# EAGLE design SensorPCB (EAGLE 7.4.0)
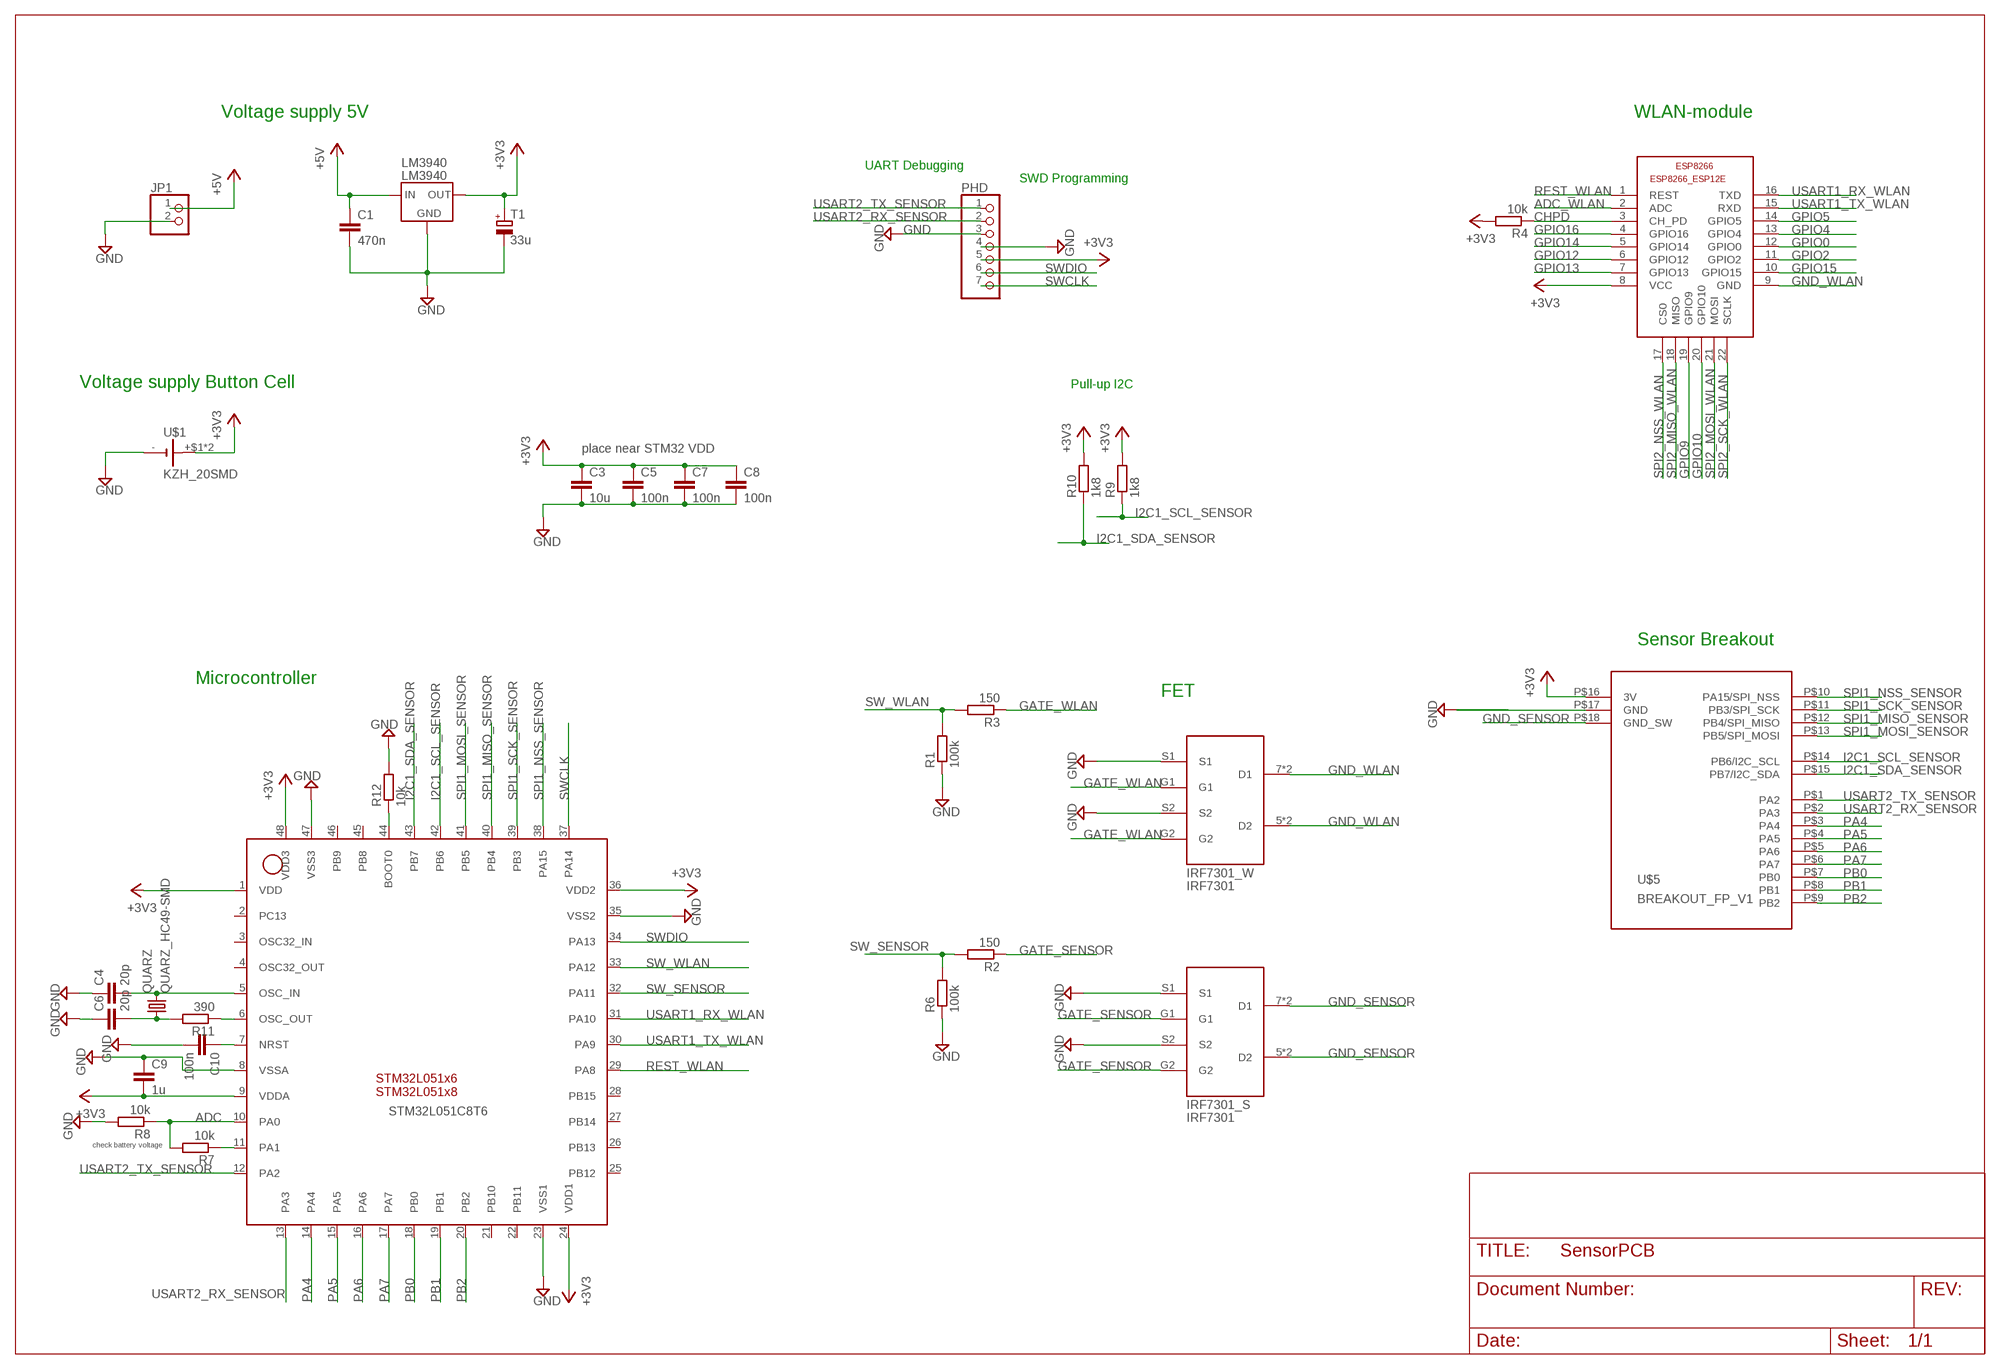
[diagram p0: schematic, sheet 1]

## Parts
C1  470n  C-EUC0805  [C0805]
C3  10u  C-EUC0805  [C0805]
C4  20p  C-EUC0805  [C0805]
C5  100n  C-EUC0805  [C0805]
C6  20p  C-EUC0805  [C0805]
C7  100n  C-EUC0805  [C0805]
C8  100n  C-EUC0805  [C0805]
C9  1u  C-EUC0805  [C0805]
C10  100n  C-EUC0805  [C0805]
ESP8266  ESP8266-12EESP8266-ESP12E  [ESP8266-ESP12E]
IRF7301_S  IRF7301  [IRF7301_PACK_SO8]
IRF7301_W  IRF7301  [IRF7301_PACK_SO8]
JP1  PINHD-1X2_2.54-SMD  [1X02SMD]
LM3940  LM3940  [LM3940_PACK]
PHD  PINHD-1X7_2.54-SMD  [1X07SMD]
QUARZ  QUARZ_HC49-SMD  [HC49-SMD]
R1  100k  R-EU_R0805  [R0805]
R2  150  R-EU_R0805  [R0805]
R3  150  R-EU_R0805  [R0805]
R4  10k  R-EU_R0805  [R0805]
R6  100k  R-EU_R0805  [R0805]
R7  10k  R-EU_R0805  [R0805]
R8  10k  R-EU_R0805  [R0805]
R9  1k8  R-EU_R0805  [R0805]
R10  1k8  R-EU_R0805  [R0805]
R11  390  R-EU_R0805  [R0805]
R12  10k  R-EU_R0805  [R0805]
STM32L051C8T6  STM32L051X6/8  [LQFP48]
T1  33u  CAP_TANTAL_1206  [1206]
U$1  KZH_20SMD  [KHZ_20SMD]
U$5  BREAKOUT_FP_V1  [BREAKOUT_FOOTPRINT_V1]

## Nets
+3V3: C3.1 C5.1 C7.1 C8.1 C9.2 ESP8266.8(VCC) LM3940.3(OUT) PHD.5 R4.2 R9.2 R10.2 STM32L051C8T6.1(VDD) STM32L051C8T6.9(VDDA) STM32L051C8T6.24(VDD1) STM32L051C8T6.36(VDD2) STM32L051C8T6.48(VDD3) T1.1(+) U$1.+$1(+) U$1.+$2(+) U$5.P$16(3V)
+5V: C1.1 JP1.1 LM3940.1(IN)
ADC: R7.2 R8.1 STM32L051C8T6.10(PA0)
ADC_WLAN: ESP8266.2(ADC)
CHPD: ESP8266.3(CH_PD) R4.1
GATE_SENSOR: IRF7301_S.G1 IRF7301_S.G2 R2.1
GATE_WLAN: IRF7301_W.G1 IRF7301_W.G2 R3.1
GND: C1.2 C3.2 C4.1 C5.2 C6.1 C7.2 C8.2 C9.1 C10.2 IRF7301_S.S1 IRF7301_S.S2 IRF7301_W.S1 IRF7301_W.S2 JP1.2 LM3940.2(GND) LM3940.4(GND) PHD.3 PHD.4 R1.1 R6.1 R8.2 R12.2 STM32L051C8T6.8(VSSA) STM32L051C8T6.23(VSS1) STM32L051C8T6.35(VSS2) STM32L051C8T6.47(VSS3) T1.2(-) U$1.- U$5.P$17(GND)
GND_SENSOR: IRF7301_S.5(D2) IRF7301_S.7(D1) IRF7301_S.D1 IRF7301_S.D2 U$5.P$18(GND_SW)
GND_WLAN: ESP8266.9(GND) IRF7301_W.5(D2) IRF7301_W.7(D1) IRF7301_W.D1 IRF7301_W.D2
GPIO0: ESP8266.12(GPIO0)
GPIO2: ESP8266.11(GPIO2)
GPIO4: ESP8266.13(GPIO4)
GPIO5: ESP8266.14(GPIO5)
GPIO9: ESP8266.19(GPIO9)
GPIO10: ESP8266.20(GPIO10)
GPIO12: ESP8266.6(GPIO12)
GPIO13: ESP8266.7(GPIO13)
GPIO14: ESP8266.5(GPIO14)
GPIO15: ESP8266.10(GPIO15)
GPIO16: ESP8266.4(GPIO16)
I2C1_SCL_SENSOR: R9.1 STM32L051C8T6.42(PB6) U$5.P$14(PB6/I2C_SCL)
I2C1_SDA_SENSOR: R10.1 STM32L051C8T6.43(PB7) U$5.P$15(PB7/I2C_SDA)
N$1: R7.1 STM32L051C8T6.11(PA1)
N$4: C6.2 QUARZ.1 R11.2
N$7: C10.1 STM32L051C8T6.7(NRST)
N$8: R12.1 STM32L051C8T6.44(BOOT0)
OSC_IN: C4.2 QUARZ.2 STM32L051C8T6.5(OSC_IN)
OSC_OUT: R11.1 STM32L051C8T6.6(OSC_OUT)
PA4: STM32L051C8T6.14(PA4) U$5.P$3(PA4)
PA5: STM32L051C8T6.15(PA5) U$5.P$4(PA5)
PA6: STM32L051C8T6.16(PA6) U$5.P$5(PA6)
PA7: STM32L051C8T6.17(PA7) U$5.P$6(PA7)
PB0: STM32L051C8T6.18(PB0) U$5.P$7(PB0)
PB1: STM32L051C8T6.19(PB1) U$5.P$8(PB1)
PB2: STM32L051C8T6.20(PB2) U$5.P$9(PB2)
REST_WLAN: ESP8266.1(REST) STM32L051C8T6.29(PA8)
SPI1_MISO_SENSOR: STM32L051C8T6.40(PB4) U$5.P$12(PB4/SPI_MISO)
SPI1_MOSI_SENSOR: STM32L051C8T6.41(PB5) U$5.P$13(PB5/SPI_MOSI)
SPI1_NSS_SENSOR: STM32L051C8T6.38(PA15) U$5.P$10(PA15/SPI_NSS)
SPI1_SCK_SENSOR: STM32L051C8T6.39(PB3) U$5.P$11(PB3/SPI_SCK)
SPI2_MISO_WLAN: ESP8266.18(MISO)
SPI2_MOSI_WLAN: ESP8266.21(MOSI)
SPI2_NSS_WLAN: ESP8266.17(CS0)
SPI2_SCK_WLAN: ESP8266.22(SCLK)
SW_SENSOR: R2.2 R6.2 STM32L051C8T6.32(PA11)
SW_WLAN: R1.2 R3.2 STM32L051C8T6.33(PA12)
SWCLK: PHD.7 STM32L051C8T6.37(PA14)
SWDIO: PHD.6 STM32L051C8T6.34(PA13)
USART1_RX_WLAN: ESP8266.16(TXD) STM32L051C8T6.31(PA10)
USART1_TX_WLAN: ESP8266.15(RXD) STM32L051C8T6.30(PA9)
USART2_RX_SENSOR: PHD.2 STM32L051C8T6.13(PA3) U$5.P$2(PA3)
USART2_TX_SENSOR: PHD.1 STM32L051C8T6.12(PA2) U$5.P$1(PA2)
Unconnected: STM32L051C8T6.2(PC13) STM32L051C8T6.3(OSC32_IN) STM32L051C8T6.4(OSC32_OUT) STM32L051C8T6.21(PB10) STM32L051C8T6.22(PB11) STM32L051C8T6.25(PB12) STM32L051C8T6.26(PB13) STM32L051C8T6.27(PB14) STM32L051C8T6.28(PB15) STM32L051C8T6.45(PB8) STM32L051C8T6.46(PB9)

## Notes on the sheet
- WLAN-module
- Voltage supply 5V
- UART Debugging
- SWD Programming
- Voltage supply Button Cell | Pull-up I2C
- place near STM32 VDD
- Sensor Breakout
- Microcontroller
- FET
- check battery voltage

## Library data of the parts
C1 C3-C10 = rcl:C-EU: CAPACITOR, European symbol
ESP8266 = ESP8266-ESP12E:ESP8266-12E: ESP8266-12E with additional I/O and GPIO04/05 corrected The author cannot warrant that this library is free from error or will meet your specific requirements. Created by PuceBaboon.com. Komagane, Nagano, JAPAN
IRF7301_S IRF7301_W = irf7301_symb:IRF7301
JP1 = pinhead:PINHD-1X2: PIN HEADER
LM3940 = lm3940:LM3940; WEBSITE: http://www.reichelt.de/LM-3940-IS3-3/3/index.html?&ACTION=3&LA=446&ARTICLE=109408&artnr=LM+3940+IS3%2C3&SEARCH=SPANNUNGsregler+3%2C3v
PHD = pinhead:PINHD-1X7: PIN HEADER
QUARZ = quarz_hc49_smd:QUARZ_HC49-SMD
R1-R4 R6-R12 = rcl:R-EU_: RESISTOR, European symbol
STM32L051C8T6 = STM32L051x6_LQFP48XXL:STM32L051X6/8
T1 = CAP_TANTAL_1206:CAP_TANTAL_1206
U$1 = KZH_20SMD:KZH_20SMD
U$5 = breakout_base:BREAKOUT_FP_V1

## Board
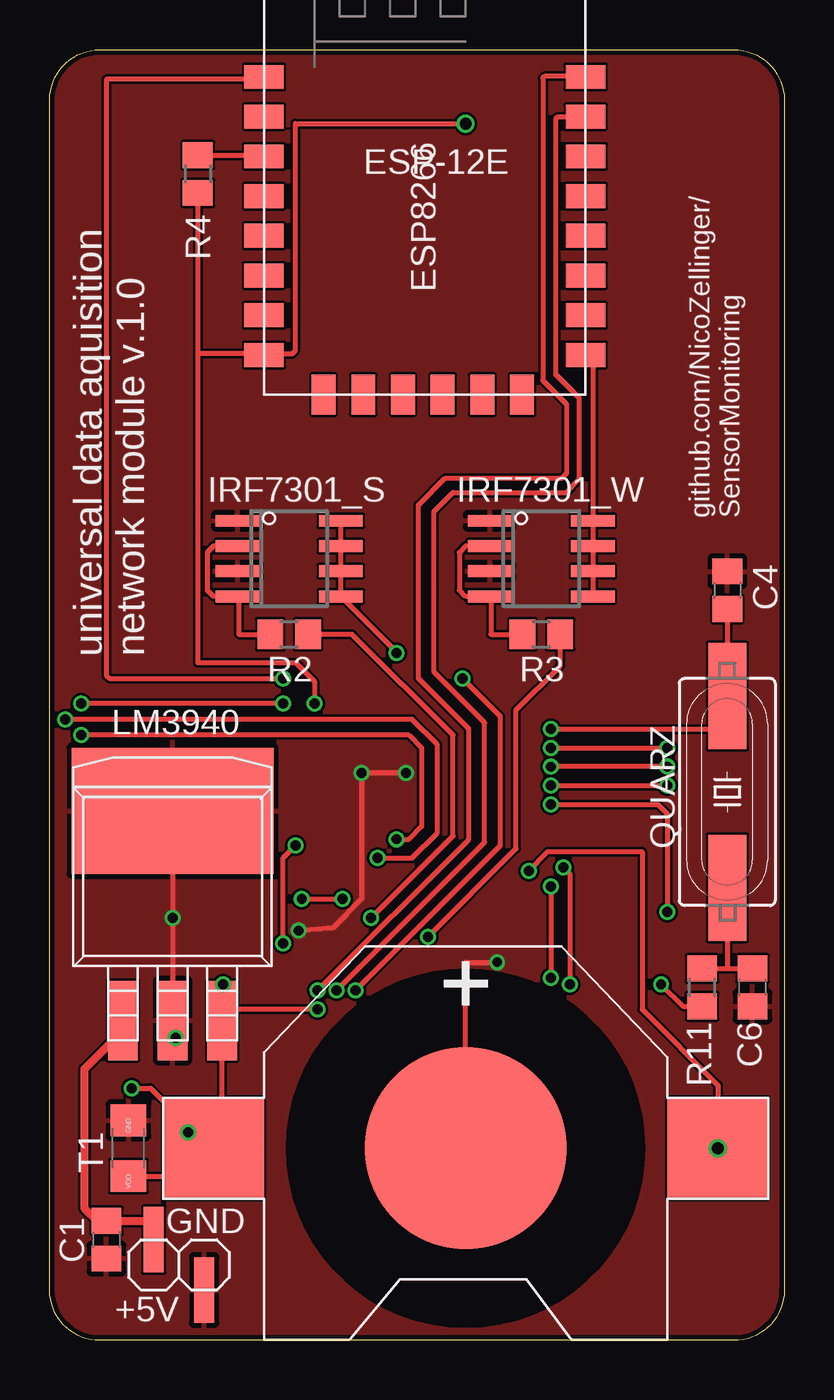
[diagram p1: board, top side]
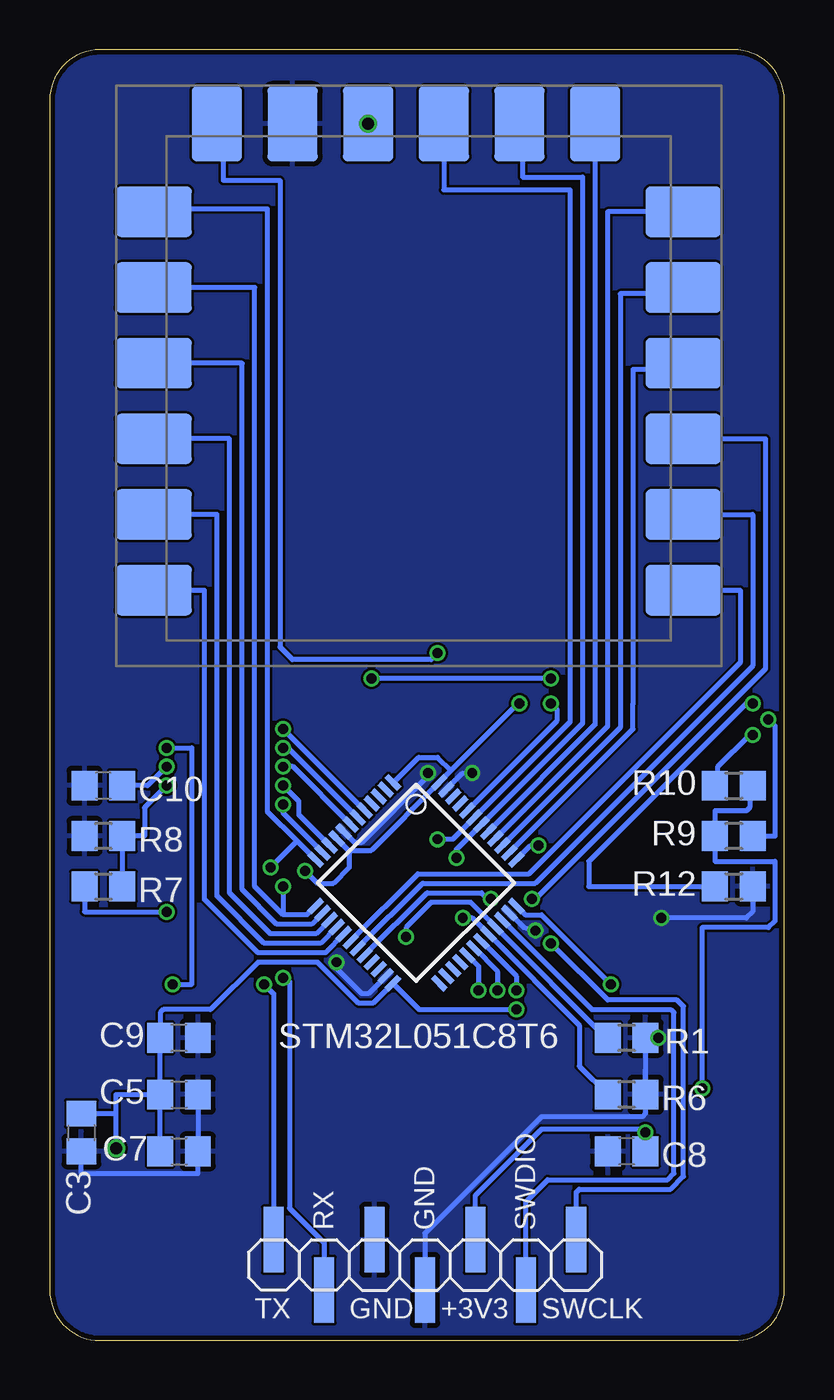
[diagram p2: board, bottom side, seen from below]

Size 37 x 65 mm. Coordinates in mm from the lower left corner, seen from the top.
Outline: 37,62.46 37,2.54 arc-90 34.46,0 2.54,0 arc-90 0,2.54 0,62.46 arc-90 2.54,65 34.46,65 arc-90 37,62.46
Copper layers (1*16): Top 0.035mm / dielectric 1.5mm / Bottom 0.035mm
Design rules "dirt_cheap_dirty_boards.v1": minimum track width 5mil, minimum drill 12mil, track to track 5mil, track to pad 5mil, pad to pad 5mil, via to via 5mil, smd to smd 0mil, copper to edge 10mil, drill to drill 10mil, minimum pad ring 10mil, minimum via ring 6mil, stop-mask expansion 2mil, vias tented up to drill 25mil, thermal gap 10mil

### Footprints (pad centres in the part's own frame; a part is rotated, then mirrored left to right if it is on the bottom)
C0805 = smd 1.3 x 1.5: 1 -0.95,0; 2 0.95,0
ESP8266-ESP12E = smd 2 x 1.2: 1 0,16; 2 0,14; 3 0,12; 4 0,10; 5 0,8; 6 0,6; 7 0,4; 8 0,2; 9 16.2,2; 10 16.2,4; 11 16.2,6; 12 16.2,8; 13 16.2,10; 14 16.2,12; 15 16.2,14; 16 16.2,16 | smd 1.2 x 2: 17 11,0; 18 3,0; 19 5,0; 20 13,0; 21 7,0; 22 9,0
IRF7301_PACK_SO8 = smd 0.6 x 2.2: 5 1.905,2.6; 7 -0.635,2.6; D1 -1.905,2.6; D2 0.635,2.6; G1 -0.635,-2.6; G2 1.905,-2.6; S1 -1.905,-2.6; S2 0.635,-2.6
1X02SMD = smd 1.016 x 3.302: 1 -1.27,1.27; 2 1.27,-1.27
LM3940_PACK = smd 1.5 x 4: 1 -2.5,-8.02; 2 0,-8.02; 3 2.5,-8.02 | smd 10.16 x 6.35: 4 0,2.54
1X07SMD = smd 1.016 x 3.302: 1 -1.27,1.27; 2 1.27,-1.27; 3 3.81,1.27; 4 6.35,-1.27; 5 8.89,1.27; 6 11.43,-1.27; 7 13.97,1.27
HC49-SMD = smd 5.334 x 1.93: 1 -4.826,0; 2 4.826,0
R0805 = smd 1.3 x 1.5: 1 -0.95,0; 2 0.95,0
LQFP48 = smd 0.9 x 0.3: 1 -4.4,2.75; 2 -4.4,2.25; 3 -4.4,1.75; 4 -4.4,1.25; 5 -4.4,0.75; 6 -4.4,0.25; 7 -4.4,-0.25; 8 -4.4,-0.75; 9 -4.4,-1.25; 10 -4.4,-1.75; 11 -4.4,-2.25; 12 -4.4,-2.75; 25 4.4,-2.75; 26 4.4,-2.25; 27 4.4,-1.75; 28 4.4,-1.25; 29 4.4,-0.75; 30 4.4,-0.25; 31 4.4,0.25; 32 4.4,0.75; 33 4.4,1.25; 34 4.4,1.75; 35 4.4,2.25; 36 4.4,2.75 | smd 0.3 x 0.9: 13 -2.75,-4.4; 14 -2.25,-4.4; 15 -1.75,-4.4; 16 -1.25,-4.4; 17 -0.75,-4.4; 18 -0.25,-4.4; 19 0.25,-4.4; 20 0.75,-4.4; 21 1.25,-4.4; 22 1.75,-4.4; 23 2.25,-4.4; 24 2.75,-4.4; 37 2.75,4.4; 38 2.25,4.4; 39 1.75,4.4; 40 1.25,4.4; 41 0.75,4.4; 42 0.25,4.4; 43 -0.25,4.4; 44 -0.75,4.4; 45 -1.25,4.4; 46 -1.75,4.4; 47 -2.25,4.4; 48 -2.75,4.4
1206 = smd 1.6 x 1.8: 1 -1.4,0; 2 1.4,0
KHZ_20SMD = smd 5.08 x 5.08: +$1 -12.7,0; +$2 12.7,0 | smd 10.16 x 10.16: - 0,0
BREAKOUT_FOOTPRINT_V1 = smd 2.54 x 3.81: P$1 6.35,1.905; P$2 10.16,1.905; P$3 13.97,1.905; P$4 17.78,1.905; P$5 21.59,1.905; P$6 25.4,1.905; P$7 25.4,28.575; P$8 21.59,28.575; P$9 17.78,28.575; P$10 13.97,28.575; P$11 10.16,28.575; P$12 6.35,28.575 | smd 3.81 x 2.54: P$13 1.905,24.13; P$14 1.905,20.32; P$15 1.905,16.51; P$16 1.905,12.7; P$17 1.905,8.89; P$18 1.905,5.08

### Placement (x,y rotation side)
C1  2.86,5.08 270 top
C3  35.4,10.48 270 bottom
C4  34.13,37.78 270 top
C5  30.48,12.38 0 bottom
C6  35.4,17.78 90 top
C7  30.48,9.53 0 bottom
C8  7.94,9.53 180 bottom
C9  30.48,15.24 180 bottom
C10  34.29,27.94 180 bottom
ESP8266  10.79,47.62 0 top
IRF7301_S  12.06,39.37 270 top
IRF7301_W  24.77,39.37 270 top
JP1  6.51,3.81 0 top
LM3940  6.19,24.13 0 top
PHD  24.45,3.81 0 bottom
QUARZ  34.13,27.62 90 top
R1  7.94,15.24 180 bottom
R2  12.06,35.56 0 top
R3  24.77,35.56 0 top
R4  7.46,58.74 270 top
R6  7.94,12.38 180 bottom
R7  34.29,22.86 0 bottom
R8  34.29,25.4 180 bottom
R9  2.54,25.4 180 bottom
R10  2.54,27.94 0 bottom
R11  32.86,17.78 90 top
R12  2.54,22.86 0 bottom
STM32L051C8T6  18.55,23.05 315 bottom
T1  3.97,9.68 90 top
U$1  20.95,9.68 180 top
U$5  33.66,63.18 270 bottom

### Tracks (layer width: path | path; a pad name or v marks a point on that pad's centre or on a via)
+3V3  (via drill 0.5, 0.6)
  Top 0.254: 7.46,49.69 10.73,49.69 ESP8266.8 10.89,49.53 11.05,49.69 12.22,49.69 12.38,49.85 12.38,61.28 v20.95,61.28 | T1.1 4,8.26 6.35,8.26 7.62,9.53 | 7.62,9.53 7.78,9.68 U$1.+$2 8.69,10.12 LM3940.3 8.57,16.23 v8.73,17.94 8.73,16.67 | 7.62,9.53 C8.1 v6.99,10.48 6.99,10.79 5.08,12.7 v4.13,12.7 | U$1.+$1 33.66,12.86 29.84,16.67 29.84,24.61 25.08,24.61 v24.13,23.65 | 7.46,49.69 7.46,34.13 12.38,34.13 13.34,33.18 v13.34,32.07 | 8.73,16.67 8.73,15.72 9.05,16.03 | v13.49,16.67 8.73,16.67 | R4.2 7.46,49.69
  Bottom 0.254: STM32L051C8T6.1 19.69,28.1 18.42,29.37 17.46,29.37 16.79,28.69 | C5.1 33.66,12.38 33.66,11.43 | C7.1 C5.1 | 33.66,10.16 U$1.+$1 33.66,11.43 | C5.1 C9.2 31.43,16.51 31.27,16.67 28.89,16.67 26.51,19.05 23.5,19.05 21.43,16.99 20.72,16.99 STM32L051C8T6.24 18.39,16.67 v13.49,16.67 | 7.22,9.13 7.22,9.29 C8.1 v6.99,10.48 7.14,10.64 12.22,10.64 15.56,7.3 PHD.5 | 35.24,11.43 C3.1 34.92,11.43 33.66,11.43 | R10.2 1.75,27.78 1.75,26.83 1.91,26.67 3.49,26.67 R9.2 3.65,25.24 3.49,25.08 3.49,24.13 0.48,24.13 0.48,21.11 0.79,20.8 4.13,20.8 v4.13,12.7 | STM32L051C8T6.9 21.88,24.61 | 21.88,24.61 21.91,24.57 21.91,23.81 22.7,23.02 23.5,23.02 v24.13,23.65 | 16.79,28.69 STM32L051C8T6.48 20.8,24.68 21.8,24.68 21.88,24.61 | 16.79,28.69 13.41,32.07 v13.34,32.07 | v8.73,17.94 12.22,21.43 13.04,21.43 STM32L051C8T6.36
  other vias: 33.66,9.68
+5V
  Top 0.406: 4.17,16.07 LM3940.1 3.69,15.6 1.75,13.65 1.75,6.67 2.38,6.03 C1.1 | C1.1 2.38,5.55 | 5.4,5.55 JP1.1 5.4,6.03 C1.1
ADC  (via drill 0.5)
  Top 0.254: v25.24,27.94 v31.11,27.94
  Bottom 0.254: R7.2 R8.1 32.23,25.4 32.23,26.83 v31.11,27.94 | STM32L051C8T6.10 24.45,26.47 24.45,27.15 v25.24,27.94
CHPD
  Top 0.254: 10.73,59.69 ESP8266.3 10.79,59.69 R4.1
GATE_SENSOR
  Top 0.254: R2.1 9.53,35.56 9.53,37.41 IRF7301_S.G2 8.26,37.47 7.94,37.78 7.94,39.69 8.26,40.01 IRF7301_S.G1
GATE_WLAN
  Top 0.254: R3.1 22.23,35.56 22.23,37.41 IRF7301_W.G2 20.95,37.47 20.64,37.78 20.64,39.69 20.95,40.01 IRF7301_W.G1
GND  (via drill 0.5)
  Top 0.254: v12.54,20.64 14.29,20.8 15.72,22.23 v15.72,28.57 | 16.19,28.57 v15.72,28.57 | v17.94,28.57 v15.72,28.57 | v6.35,15.24 6.19,15.4 LM3940.2 v6.19,21.27 LM3940.4 | T1.2 3.33,11.72 | U$1.- 20.95,19.05 v22.54,19.05
  Bottom 0.254: STM32L051C8T6.35 13.12,20.8 v12.54,20.64 | STM32L051C8T6.47 16.2,28.57 v15.72,28.57 | STM32L051C8T6.8 21.64,25.08 21.27,25.08 17.94,28.42 v17.94,28.57 | C5.2 C7.2 29.53,8.41 35.4,8.41 C3.2 | R6.1 R1.1 v6.35,15.24 | R6.1 6.99,13.65 | R6.1 6.99,11.43 7.14,11.27 12.22,11.27 18.1,5.4 PHD.4 | R12.2 1.59,21.59 1.91,21.27 v6.19,21.27 | STM32L051C8T6.23 20.95,17.46 21.27,17.46 22.54,18.73 v22.54,19.05
  pour Top: 36.99,62.39 36.99,2.54 arc-90 34.45,0 2.54,0 arc-90 0,2.54 0,62.39 arc-90 2.54,64.93 34.45,64.93 arc-90
  pour Bottom: 36.99,62.39 36.99,2.54 arc-90 34.45,0 2.54,0 arc-90 0,2.54 0,62.39 arc-90 2.54,64.93 34.45,64.93 arc-90
GND_SENSOR  (via drill 0.5)
  Top 0.254: IRF7301_S.D1 IRF7301_S.7 IRF7301_S.D2 IRF7301_S.5 17.46,34.67 v17.46,34.61
  Bottom 0.254: U$5.P$18 28.26,60.96 28.26,58.42 25.4,58.42 25.4,34.92 24.77,34.29 17.78,34.29 v17.46,34.61
GND_WLAN
  Top 0.254: IRF7301_W.5 IRF7301_W.D2 IRF7301_W.7 IRF7301_W.D1 27.36,49.26 ESP8266.9
I2C1_SCL_SENSOR  (via drill 0.5)
  Top 0.254: v16.51,24.29 18.26,24.29 19.53,25.56 19.53,30 18.26,31.27 v0.79,31.27
  Bottom 0.254: U$5.P$14 13.18,61.12 13.18,58.58 10.16,58.58 10.16,31.08 STM32L051C8T6.42 16.51,24.73 v16.51,24.29 | v0.79,31.27 0.48,30.96 0.48,25.4 R9.1
I2C1_SDA_SENSOR  (via drill 0.5)
  Top 0.254: v1.59,30.48 18.1,30.48 18.73,29.84 18.73,25.88 18.1,25.24 v17.46,25.24
  Bottom 0.254: U$5.P$15 17.14,57.94 10.79,57.94 10.79,31.15 STM32L051C8T6.43 16.7,25.24 v17.46,25.24 | v1.59,30.48 1.75,30.48 3.33,28.89 3.33,28.1 R10.1
N$1  (via drill 0.5)
  Top 0.254: v25.24,26.99 30.64,26.99 31.11,26.51 v31.11,21.59
  Bottom 0.254: STM32L051C8T6.11 25.24,26.56 v25.24,26.99 | R7.1 35.24,21.59 v31.11,21.59
N$4
  Top 0.254: QUARZ.1 34.13,18.73 | 34.13,18.73 C6.2 | R11.2 34.13,18.73
N$7  (via drill 0.5)
  Top 0.254: v31.11,28.89 v25.24,28.89
  Bottom 0.254: STM32L051C8T6.7 24.75,28.89 v25.24,28.89 | v31.11,28.89 32.07,27.94 C10.1
N$8  (via drill 0.5)
  Top 0.254: v11.75,32.07 v1.59,32.07
  Bottom 0.254: STM32L051C8T6.44 11.43,31.22 11.43,31.75 v11.75,32.07 | v1.59,32.07 1.91,32.07 9.84,24.13 9.84,22.86 R12.1
OSC_IN  (via drill 0.5)
  Top 0.254: QUARZ.2 34.07,32.38 | C4.2 QUARZ.2 | v25.24,30.8 34.13,30.8 QUARZ.2
  Bottom 0.254: STM32L051C8T6.5 v25.24,30.8
OSC_OUT  (via drill 0.5)
  Top 0.254: v25.24,29.84 v31.11,29.84 | v30.8,17.94 31.91,16.83 32.38,16.83 | 32.38,16.83 32.7,16.83 | R11.1 32.39,16.83 32.38,16.83
  Bottom 0.254: STM32L051C8T6.6 24.99,29.84 v25.24,29.84 | v31.11,29.84 29.84,29.84 29.84,17.94 v30.8,17.94
PA4
  Bottom 0.254: U$5.P$3 27.3,49.21 27.3,22.7 25.56,20.95 23.82,20.95 STM32L051C8T6.14
PA5
  Bottom 0.254: U$5.P$4 27.94,45.4 27.94,22.54 25.88,20.48 23.59,20.48 STM32L051C8T6.15
PA6
  Bottom 0.254: U$5.P$5 28.57,41.59 28.57,22.38 26.19,20 23.36,20 STM32L051C8T6.16
PA7
  Bottom 0.254: U$5.P$6 29.21,37.78 29.21,22.23 26.51,19.53 23.13,19.53 STM32L051C8T6.17
PB0
  Bottom 0.254: STM32L051C8T6.18 18.45,23.5 12.86,23.5 2.22,34.13 2.22,37.78 U$5.P$7
PB1
  Bottom 0.254: STM32L051C8T6.19 18.22,23.02 12.54,23.02 1.59,33.97 1.59,41.59 U$5.P$8
PB2  (via drill 0.5)
  Top 0.254: v12.7,22.23 v14.76,22.23
  Bottom 0.254: U$5.P$9 0.95,45.4 0.95,33.81 12.54,22.23 v12.7,22.23 | STM32L051C8T6.20 17.99,22.54 15.24,22.54 14.92,22.23 v14.76,22.23
REST_WLAN  (via drill 0.5)
  Top 0.254: v15.4,17.62 22.7,24.92 22.7,31.43 v20.8,33.34 | ESP8266.1 10.67,63.5 2.86,63.5 2.86,33.5 3.02,33.34 v11.75,33.34
  Bottom 0.254: STM32L051C8T6.29 15.4,18.84 v15.4,17.62 | v11.75,33.34 v20.8,33.34
SPI1_MISO_SENSOR
  Bottom 0.254: U$5.P$12 8.89,56.83 8.89,30.93 STM32L051C8T6.40
SPI1_MOSI_SENSOR
  Bottom 0.254: U$5.P$13 9.53,31.01 STM32L051C8T6.41
SPI1_NSS_SENSOR
  Bottom 0.254: U$5.P$10 5.4,48.9 7.62,48.9 7.62,32.38 7.62,32.07 7.62,30.79 STM32L051C8T6.38
SPI1_SCK_SENSOR
  Bottom 0.254: U$5.P$11 5.4,52.7 8.26,52.7 8.26,30.86 STM32L051C8T6.39
SW_SENSOR  (via drill 0.5)
  Top 0.254: v16.19,21.27 20.32,25.4 20.32,30.48 15.24,35.56 R2.2
  Bottom 0.254: v16.19,21.27 15.71,21.27 STM32L051C8T6.32 10.32,15.88 10.32,13.81 R6.2
SW_WLAN  (via drill 0.5)
  Top 0.254: R3.2 25.71,33.97 23.5,31.75 23.5,24.77 v19.05,20.32
  Bottom 0.254: v19.05,20.32 19.05,20.8 17.78,22.07 15.8,22.07 STM32L051C8T6.33 8.97,15.24 R1.2
SWCLK  (via drill 0.5)
  Top 0.254: v12.38,24.92 11.75,24.29 v11.75,20
  Bottom 0.254: PHD.7 10.48,7.46 10.32,7.62 5.71,7.62 5.08,8.26 5.08,16.83 5.4,17.14 8.89,17.14 v11.75,20 | STM32L051C8T6.37 12.78,24.92 v12.38,24.92
SWDIO
  Bottom 0.254: PHD.6 13.02,6.99 11.91,8.1 5.87,8.1 5.56,8.41 5.56,16.51 5.71,16.67 9.69,16.67 STM32L051C8T6.34
USART1_RX_WLAN  (via drill 0.5)
  Top 0.254: v13.49,17.62 21.11,25.24 21.11,30.8 18.57,33.34 18.57,42.07 19.92,43.42 25.8,43.42 26.04,43.66 26.04,47.15 24.84,48.34 24.84,63.58 24.92,63.66 26.96,63.66 ESP8266.16
  Bottom 0.254: STM32L051C8T6.31 13.49,18.35 v13.49,17.62
USART1_TX_WLAN  (via drill 0.5)
  Top 0.254: v14.45,17.62 21.91,25.08 21.91,31.11 19.37,33.66 19.37,41.75 20.32,42.7 26.04,42.7 26.67,43.34 26.67,47.47 25.48,48.66 25.48,61.52 25.56,61.59 26.96,61.59 ESP8266.15
  Bottom 0.254: STM32L051C8T6.30 14.45,18.59 v14.45,17.62
USART2_RX_SENSOR  (via drill 0.5 pad 0.25)
  Top 0.254: v25.24,22.86 v25.24,18.26
  Bottom 0.254: U$5.P$2 26.67,53.02 26.67,22.86 25.24,21.43 | STM32L051C8T6.13 23.65,21.83 | 25.24,21.43 24.05,21.43 23.65,21.83 | 23.65,21.83 23.65,21.91 | PHD.2 23.18,4.92 24.92,6.67 24.92,18.1 25.08,18.26 v25.24,18.26 | v25.24,22.86 25.24,21.43
USART2_TX_SENSOR  (via drill 0.5 pad 0.25)
  Top 0.254: v25.88,23.81 26.19,23.5 v26.19,17.94
  Bottom 0.254: U$5.P$1 31.59,56.99 26.04,56.99 26.04,26.64 24.54,25.15 | STM32L051C8T6.12 24.54,25.15 | v25.88,23.81 24.54,25.15 | 24.54,25.15 | 25.88,5.24 PHD.1 25.72,17.46 v26.19,17.94

### Text on the board
tNames: github.com/NicoZellinger/ / SensorMonitoring | universal data aquisition / network module v.1.0 | GND | +5V
bNames: SWDIO | GND | RX | SWCLK | +3V3 | GND | TX